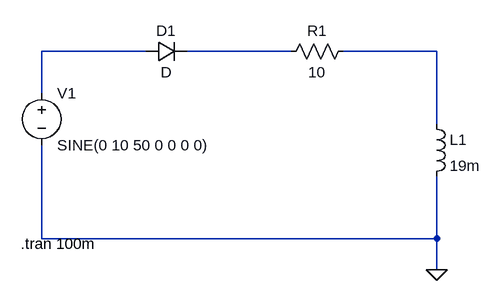
[diagram p0: schematic rectification-v2.asc]
rectification-v2.asc, the LTspice schematic file:
Version 4.1
SHEET 1 880 680
WIRE 176 96 16 96
WIRE 400 96 240 96
WIRE 624 96 480 96
WIRE 16 160 16 96
WIRE 624 208 624 96
WIRE 16 384 16 240
WIRE 624 384 624 288
WIRE 624 384 16 384
WIRE 624 432 624 384
FLAG 624 432 0
SYMBOL voltage 16 144 R0
WINDOW 123 0 0 Left 0
WINDOW 39 0 0 Left 0
SYMATTR InstName V1
SYMATTR Value SINE(0 10 50 0 0 0 0)
SYMBOL diode 176 112 R270
WINDOW 0 32 32 VTop 2
WINDOW 3 0 32 VBottom 2
SYMATTR InstName D1
SYMBOL res 496 80 R90
WINDOW 0 0 56 VBottom 2
WINDOW 3 32 56 VTop 2
SYMATTR InstName R1
SYMATTR Value 10
SYMBOL ind 608 192 R0
SYMATTR InstName L1
SYMATTR Value 19m
TEXT -16 392 Left 2 !.tran 100m

The netlist it stands for:
* rectification-v2.asc
V1 N001 0 SINE(0 10 50 0 0 0 0)
D1 N001 N002 D
R1 N003 N002 10
L1 N003 0 19m
.model D D
.lib standard.dio
.tran 100m
.backanno
.end